# EAGLE schematic UC1 (EAGLE 9.3.2)
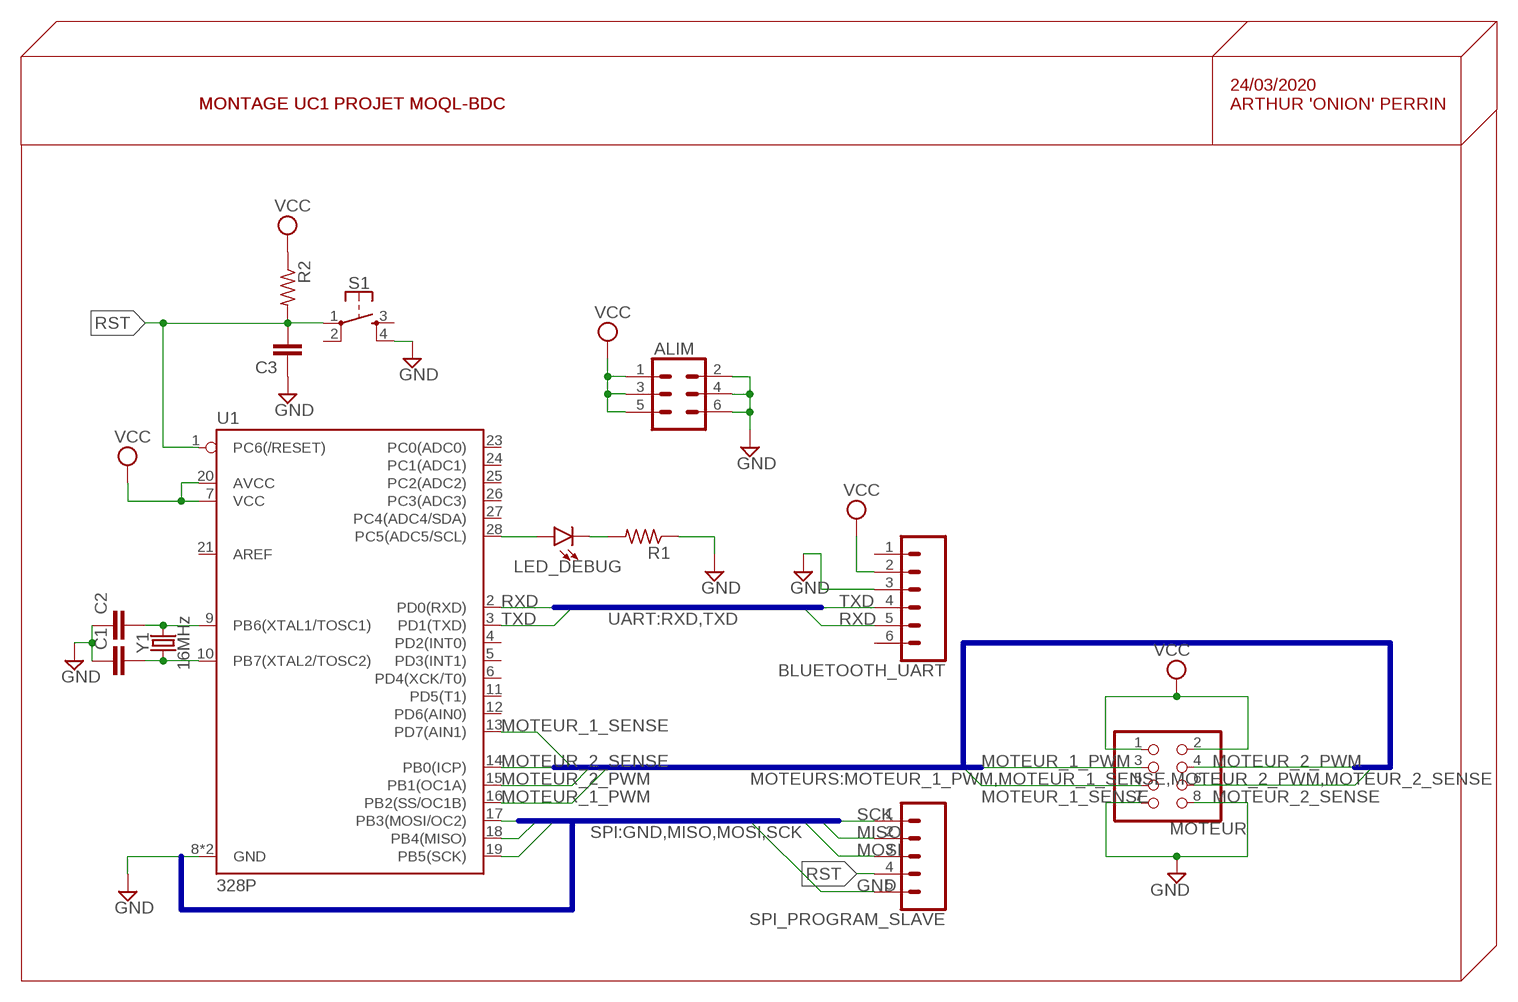
[diagram p0: schematic, sheet 1]

## Parts
ALIM  FEMALE 2x3  CONN_03X2FEMALE  [2X3]
BLUETOOTH_UART  CONN_06LOCK  [1X06_LOCK]
C1  C-EU025-025X050  [C025-025X050]
C2  C-EU025-025X050  [C025-025X050]
C3  C-EU025-025X050  [C025-025X050]
LED_DEBUG  LED3MM  [LED_3MM]
MOTEUR  FEMALE 2x3  PINHD-2X4  [2X04]
R1  R-US_0204/7  [0204/7]
R2  R-US_0204/7  [0204/7]
S1  MOMENTARY-SWITCH-SPST-2-SMD-5.2MM-TALL  [TACTILE_SWITCH_SMD_5.2MM]
SPI_PROGRAM_SLAVE  CONN_05  [1X05]
U1  328P  ATMEGA328P_PDIP  [DIP28]
Y1  16MHz  CRYSTAL-16MHZPTH-HC49US  [HC49US]

## Nets
GND: ALIM.2 ALIM.4 ALIM.6 BLUETOOTH_UART.3 C1.1 C2.1 C3.1 MOTEUR.7 MOTEUR.8 R1.1 S1.4 SPI_PROGRAM_SLAVE.5 U1.8(GND) U1.22(GND)
MISO: SPI_PROGRAM_SLAVE.2 U1.18(PB4(MISO))
MOSI: SPI_PROGRAM_SLAVE.3 U1.17(PB3(MOSI/OC2))
MOTEUR_1_PWM: MOTEUR.3 U1.16(PB2(SS/OC1B))
MOTEUR_1_SENSE: MOTEUR.5 U1.13(PD7(AIN1))
MOTEUR_2_PWM: MOTEUR.4 U1.15(PB1(OC1A))
MOTEUR_2_SENSE: MOTEUR.6 U1.14(PB0(ICP))
N$1: C2.2 U1.9(PB6(XTAL1/TOSC1)) Y1.2
N$2: C1.2 U1.10(PB7(XTAL2/TOSC2)) Y1.1
N$3: LED_DEBUG.A U1.28(PC5(ADC5/SCL))
N$4: LED_DEBUG.K(C) R1.2
RST: C3.2 R2.2 S1.1 SPI_PROGRAM_SLAVE.4 U1.1(PC6(/RESET))
RXD: BLUETOOTH_UART.5 U1.2(PD0(RXD))
SCK: SPI_PROGRAM_SLAVE.1 U1.19(PB5(SCK))
TXD: BLUETOOTH_UART.4 U1.3(PD1(TXD))
VCC: ALIM.1 ALIM.3 ALIM.5 BLUETOOTH_UART.2 MOTEUR.1 MOTEUR.2 R2.1 U1.7(VCC) U1.20(AVCC)
Unconnected: BLUETOOTH_UART.1 BLUETOOTH_UART.6 S1.2 S1.3 U1.4(PD2(INT0)) U1.5(PD3(INT1)) U1.6(PD4(XCK/T0)) U1.11(PD5(T1)) U1.12(PD6(AIN0)) U1.21(AREF) U1.23(PC0(ADC0)) U1.24(PC1(ADC1)) U1.25(PC2(ADC2)) U1.26(PC3(ADC3)) U1.27(PC4(ADC4/SDA))

## Buses
SPI:GND,MISO,MOSI,SCK
UART:RXD,TXD
MOTEURS:MOTEUR_1_PWM,MOTEUR_1_SENSE,MOTEUR_2_PWM,MOTEUR_2_SENSE

## Notes on the sheet
- MONTAGE UC1 PROJET MOQL-BDC | MONTAGE UC1 PROJET MOQL-BDC
- 24/03/2020
  ARTHUR 'ONION' PERRIN

## Library data of the parts
ALIM = SparkFun-Connectors:CONN_03X2: Multi connection point. Often used as Generic Header-pin footprint for 0.1 inch spaced/style header connections You can populate with any combo of single row headers, but if you'd like an exact match, check these: Header - 2x3 (Male, 0.1") <https://www.sparkfun.com/products/12807> (PRT-12807) Header - 2x3 (Female, 0.1") <https://www.sparkfun.com/products/13010> (PRT-13010) 2x3 Pin Shrouded Header <https://www.sparkfun.com/products/10877> (PRT-10877) On any of the 0.1 inch spaced packages, you can populate with these: Break Away Headers - Straight <https://www.sparkfun.com/products/116> (PRT-00116) Break Away Male Headers - Right Angle <https://www.sparkfun.com/products/553> (PRT-00553) Female Headers <https://www.sparkfun.com/products/115> (PRT-00115) Break Away Headers - Machine Pin <https://www.sparkfun.com/products/117> (PRT-00117) Break Away Female Headers - Swiss Machine Pin <https://www.sparkfun.com/products/743> (PRT-00743) Special note: the shrouded connector mates well with our 3x2 ribbon cables: Ribbon Crimp Connector - 6-pin (2x3, Female) <https://www.sparkfun.com/products/10651> (PRT-10651) Ribbon Cable - 6 wire (15ft) <https://www.sparkfun.com/products/10646> (PRT-10646); PROD_ID: CONN-11566
BLUETOOTH_UART = SparkFun-Connectors:CONN_06: Multi connection point. Often used as Generic Header-pin footprint for 0.1 inch spaced/style header connections On any of the 0.1 inch spaced packages, you can populate with these: Break Away Headers - Straight <https://www.sparkfun.com/products/116> (PRT-00116) Break Away Male Headers - Right Angle <https://www.sparkfun.com/products/553> (PRT-00553) Female Headers <https://www.sparkfun.com/products/115> (PRT-00115) Break Away Headers - Machine Pin <https://www.sparkfun.com/products/117> (PRT-00117) Break Away Female Headers - Swiss Machine Pin <https://www.sparkfun.com/products/743> (PRT-00743) Arduino Stackable Header - 6 Pin <https://www.sparkfun.com/products/9280> (PRT-09280) For SCREWTERMINALS and SPRING TERMINALS visit here: Screw Terimnals on SparkFun.com <https://www.sparkfun.com/search/results?term=Screw+Terminals> (5mm/3.5mm/2.54mm spacing) This device is also useful as a general connection point to wire up your design to another part of your project. Our various solder wires solder well into these plated through hole pads. Hook-Up Wire - Assortment (Stranded, 22 AWG) <https://www.sparkfun.com/products/11375> (PRT-11375) Hook-Up Wire - Assortment (Solid Core, 22 AWG) <https://www.sparkfun.com/products/11367> (PRT-11367) View the entire wire category on our website here <https://www.sparkfun.com/categories/141>
C1-C3 = rcl:C-EU: CAPACITOR, European symbol; SPICEPREFIX: C
LED_DEBUG = SparkFun-LED:LED: LED (Generic) Standard schematic elements and footprints for 5mm, 3mm, 1206, and 0603 sized LEDs. Generic LEDs with no color specified.; PROD_ID: DIO-08794
MOTEUR = pinhead:PINHD-2X4: PIN HEADER
R1 R2 = rcl:R-US_: RESISTOR, American symbol; SPICEPREFIX: R
S1 = SparkFun-Switches:MOMENTARY-SWITCH-SPST-2: Momentary Switch (Pushbutton) - SPST - Two Circuits Normally-open (NO) SPST momentary switches (buttons, pushbuttons). Schematic symbol includes two switch circuits. Variants SMD-4.6MMX2.8MM - 4.60mm x 2.80mm Tactile Momentary Button Switch - Used on SparkFun SAMD21 Mini Breakout <https://www.sparkfun.com/products/13664> SMD-5.2MM - Mini Pushbutton Switch - SMD <https://www.sparkfun.com/products/8720> - Used on Arduino Pro Mini <https://www.sparkfun.com/products/11114>; PROD_ID: SWCH-14139
SPI_PROGRAM_SLAVE = SparkFun-Connectors:CONN_05: Multi connection point. Often used as Generic Header-pin footprint for 0.1 inch spaced/style header connections On any of the 0.1 inch spaced packages, you can populate with these: Break Away Headers - Straight <https://www.sparkfun.com/products/116> (PRT-00116) Break Away Male Headers - Right Angle <https://www.sparkfun.com/products/553> (PRT-00553) Female Headers <https://www.sparkfun.com/products/115> (PRT-00115) Break Away Headers - Machine Pin <https://www.sparkfun.com/products/117> (PRT-00117) Break Away Female Headers - Swiss Machine Pin <https://www.sparkfun.com/products/743> (PRT-00743) For SCREWTERMINALS and SPRING TERMINALS visit here: Screw Terimnals on SparkFun.com <https://www.sparkfun.com/search/results?term=Screw+Terminals> (5mm/3.5mm/2.54mm spacing) This device is also useful as a general connection point to wire up your design to another part of your project. Our various solder wires solder well into these plated through hole pads. Hook-Up Wire - Assortment (Stranded, 22 AWG) <https://www.sparkfun.com/products/11375> (PRT-11375) Hook-Up Wire - Assortment (Solid Core, 22 AWG) <https://www.sparkfun.com/products/11367> (PRT-11367) View the entire wire category on our website here <https://www.sparkfun.com/categories/141> Special notes: Molex polarized connector foot print use with SKU : PRT-08231 with associated crimp pins and housings. 1MM SMD Version SKU: PRT-10208
U1 = SparkFun-IC-Microcontroller:ATMEGA328P_PDIP: Atmel 328P Through hole ATMEGA328P uC used in the Arduino 32kb flash, 1k EEPROM, 2k SRAM Datasheet <http://www.sparkfun.com/datasheets/Components/SMD/ATMega328.pdf> SparkFun Products Storefront component: AVR 28 Pin 20MHz 32K 6A/D - ATMega328P <https://www.sparkfun.com/products/9061> (COM-09061) SparkFun Simon Says - Through-Hole Soldering Kit <https://www.sparkfun.com/products/10547> (KIT-10547) SparkFun Learn to Solder - Simon Says <https://www.sparkfun.com/products/13708> (KIT-13708) SparkFun BigTime Watch Kit <https://www.sparkfun.com/products/11734> (KIT-11734) SparkFun ClockIt <https://www.sparkfun.com/products/10930> (KIT-10930) SparkFun Serial Enabled LCD Kit <https://www.sparkfun.com/products/10097> (LCD-10097) SparkFun Simon Tilts - Through Hole Soldering Kit <https://www.sparkfun.com/products/12634> (KIT-12634) SparkFun Frequency Counter Kit <https://www.sparkfun.com/products/10140> (KIT-10140) FabFM Radio Kit <https://www.sparkfun.com/products/11043> (KIT-11043) SparkFun Binary Blaster Kit <https://www.sparkfun.com/products/12037> (KIT-12037) SparkFun Metro-Gnome <https://www.sparkfun.com/products/9236> (KIT-09236) ATmega328 with Arduino Optiboot (Uno) <https://www.sparkfun.com/products/10524> (DEV-10524); PROD_ID: IC-09136
Y1 = SparkFun-Clocks:CRYSTAL-16MHZ: 16MHz Crystal Digikey Example <http://www.digikey.com/product-search/en?keywords=535-9122-1-ND> Frequency: 16MHz Frequency Stability: ±50ppm Frequency Tolerance: ±20ppm Load Capacitance: 18pF SparkFun Products: Pro Micro -5V/16MHz <https://www.sparkfun.com/products/12640> SparkFun Serial Enabled LCD Kit <https://www.sparkfun.com/products/10097>; PROD_ID: XTAL-08181; SF_ID: COM-00536